# EAGLE schematic 0xD_protov1 v10 (EAGLE 9.7.0)

## Sheet 1 of 2
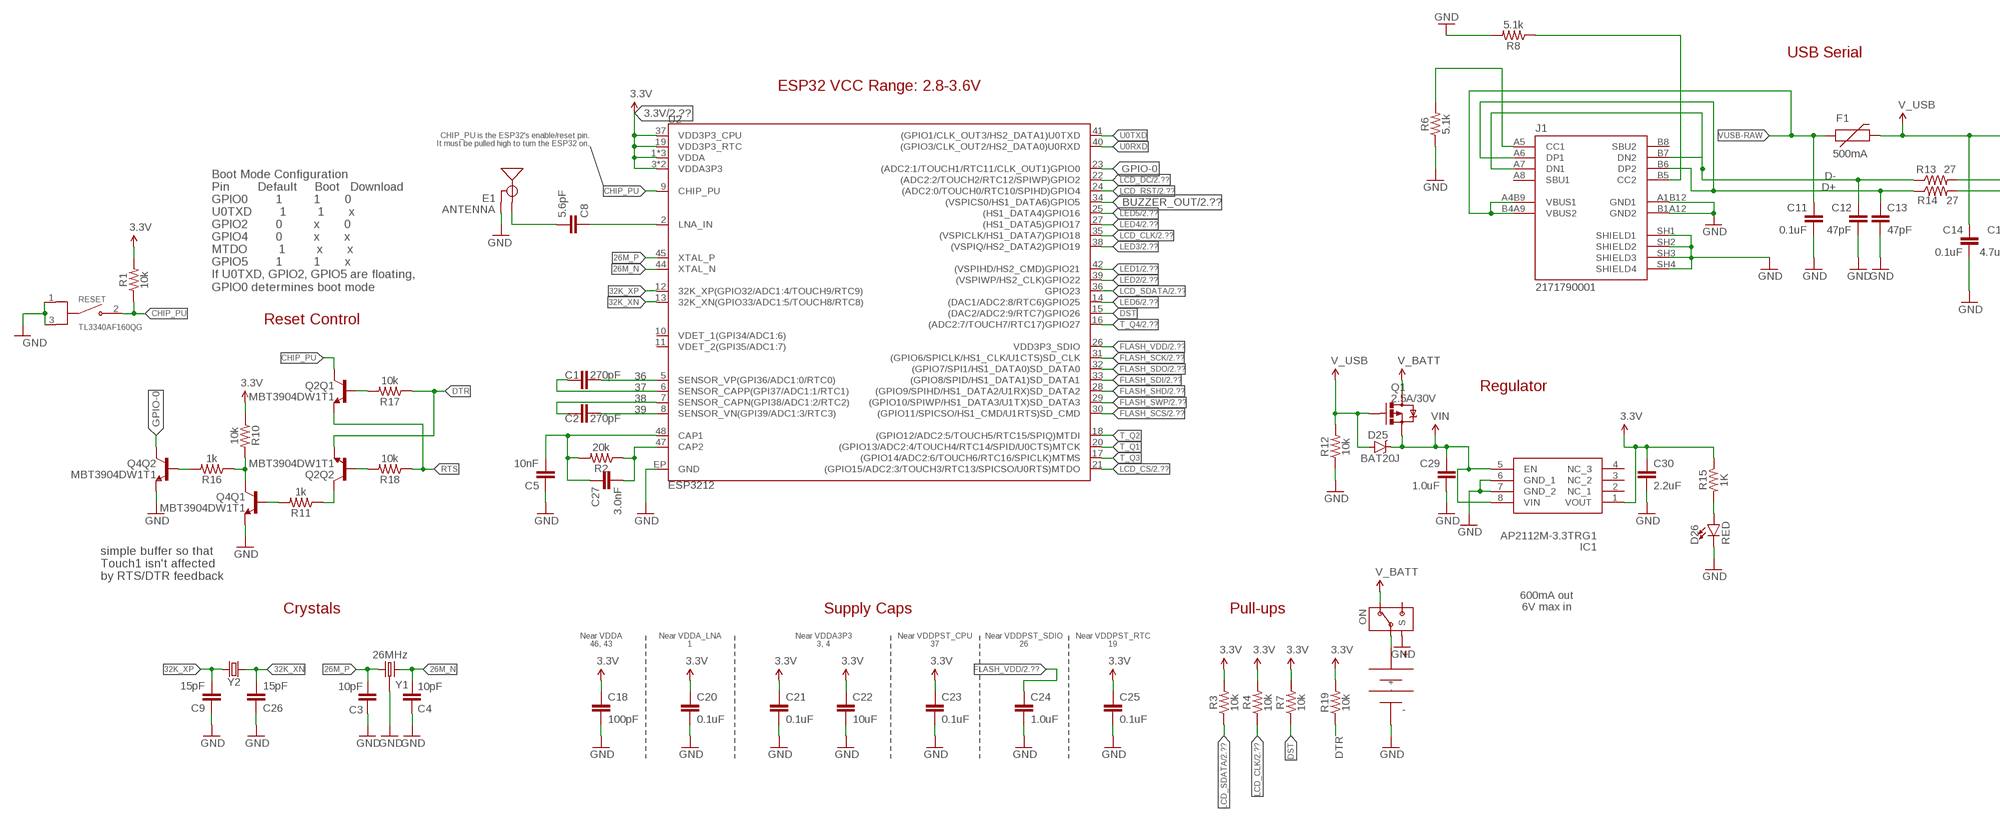
[diagram p0: schematic, sheet 1, part 1 of 2]
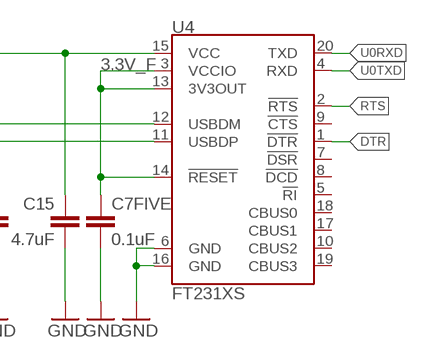
[diagram p1: schematic, sheet 1, part 2 of 2]

### Parts
C1  270pF  270PF-50V-5%(0603)  [0603]
C2  270pF  270PF-50V-5%(0603)  [0603]
C3  10pF  10PF-0603-50V-5%  [0603]
C4  10pF  10PF-0603-50V-5%  [0603]
C5  10nF  10NF-0603-50V-10%  [0603]
C7FIVE  0.1uF  0.1UF-0603-25V-(+80/-20%)  [0603]
C8  5.6pF  5.6PF-50V-5%(0603)  [0603]
C9  15pF  15PF-0603-50V-5%  [0603]
C11  0.1uF  0.1UF-0603-25V-(+80/-20%)  [0603]
C12  47pF  47PF-0603-50V-5%  [0603]
C13  47pF  47PF-0603-50V-5%  [0603]
C14  0.1uF  0.1UF-0603-25V-(+80/-20%)  [0603]
C15  4.7uF  0.1UF-0603-25V-(+80/-20%)  [0603]
C18  100pF  100PF-0603-50V-5%  [0603]
C20  0.1uF  0.1UF-0603-25V-(+80/-20%)  [0603]
C21  0.1uF  0.1UF-0603-25V-(+80/-20%)  [0603]
C22  10uF  10UF-0603-6.3V-20%  [0603]
C23  0.1uF  0.1UF-0603-25V-(+80/-20%)  [0603]
C24  1.0uF  1.0UF-0603-16V-10%  [0603]
C25  0.1uF  0.1UF-0603-25V-(+80/-20%)  [0603]
C26  15pF  15PF-0603-50V-5%  [0603]
C27  3.0nF  3.0NF-0603-50V-5%  [0603]
C29  1.0uF  1.0UF-0805-25V-(+80/-20%)  [0805]
C30  2.2uF  2.2UF-0603-10V-20%  [0603]
D25  BAT20J  DIODE-SCHOTTKY-BAT20J  [SOD-323]
D26  RED  LED-RED0603  [LED-0603@1]
E1  ANTENNA  ANTENNATRACE-TUNED  [TRACE_ANTENNA_2.4GHZ_25.7MM_TUNED]
F1  500mA  PTCSMD  [PTC-1206]
G2  KEYSTONE_2479  [KEYSTONE_2479]
IC1  AP2112M-3.3TRG1  [SOIC127P600X170-8N]
J1  2171790001  [MOLEX_2171790001]
ON  CUS-12B  [CUS-12_SPDT]
Q1  2.5A/30V  MOSFET-PCHANNELDMG2307L  [SOT23-3@1]
Q2  MBT3904DW1T1  [SC70-6]
Q4  MBT3904DW1T1  [SC70-6]
R1  10k  10KOHM-1/10W-1%(0603)0603  [0603]
R2  20k  20KOHM-0603-1/10W-1%  [0603]
R3  10k  10KOHM-0603-1/10W-1%  [0603]
R4  10k  10KOHM-0603-1/10W-1%  [0603]
R6  5.1k  10KOHM-0603-1/10W-1%  [0603]
R7  10k  10KOHM-0603-1/10W-1%  [0603]
R8  5.1k  10KOHM-0603-1/10W-1%  [0603]
R10  10k  10KOHM-0603-1/10W-1%  [0603]
R11  1k  10KOHM-0603-1/10W-1%  [0603]
R12  10k  10KOHM-0603-1/10W-1%  [0603]
R13  27  27OHM1/10W1%(0603)0603-RES  [0603]
R14  27  27OHM1/10W1%(0603)0603-RES  [0603]
R15  1K  1KOHM-1/10W-1%(0603)  [0603]
R16  1k  10KOHM-0603-1/10W-1%  [0603]
R17  10k  10KOHM-0603-1/10W-1%  [0603]
R18  10k  10KOHM-0603-1/10W-1%  [0603]
R19  10k  10KOHM-0603-1/10W-1%  [0603]
RESET  TL3340AF160QG  [SW_TL3340AF160QG]
U2  ESP3212  [QFN48-0.4MM]
U4  FT231XS  [SSOP20_L]
Y1  26MHz  CRYSTAL-GROUNDED3.2X2.5  [CRYSTAL-SMD-3.2X2.5]
Y2  32.768kHz  FC-12M  [FC-12M]

### Nets
3.3V: C18.1 C20.1 C21.1 C22.1 C23.1 C25.1 C30.1 IC1.1(VOUT) R1.2 R3.2 R4.2 R7.2 R10.1 R15.1 R19.2 U2.1(VDDA) U2.3(VDDA3P3) U2.4(VDDA3P3) U2.19(VDD3P3_RTC) U2.37(VDD3P3_CPU) U2.43(VDDA) U2.46(VDDA) ; also sheet 2
3.3V_F: C7FIVE.1 U4.3(VCCIO) U4.13(3V3OUT) U4.14(!RESET)
26M_N: C4.2 U2.44(XTAL_N) Y1.3
26M_P: C3.2 U2.45(XTAL_P) Y1.1
32K_XN: C26.2 U2.13(32K_XN(GPIO33/ADC1:5/TOUCH8/RTC8)) Y2.2
32K_XP: C9.2 U2.12(32K_XP(GPIO32/ADC1:4/TOUCH9/RTC9)) Y2.1
36: C1.2 U2.5(SENSOR_VP(GPI36/ADC1:0/RTC0))
37: C1.1 U2.6(SENSOR_CAPP(GPI37/ADC1:1/RTC1))
38: C2.1 U2.7(SENSOR_CAPN(GPI38/ADC1:2/RTC2))
39: C2.2 U2.8(SENSOR_VN(GPI39/ADC1:3/RTC3))
BUZZER_OUT: U2.34((VSPICS0/HS1_DATA6)GPIO5) ; also sheet 2
CAP_10N: C5.2 C27.1 R2.2 U2.48(CAP1)
CHIP_PU: Q2.3(Q1:C) R1.1 RESET.2(NO) U2.9(CHIP_PU)
D+: C13.1 J1.A6(DP1) J1.B6(DP2) R14.1
D-: C12.1 J1.A7(DN1) J1.B7(DN2) R13.1
DST: R7.1 U2.15((DAC2/ADC2:9/RTC7)GPIO26)
DTR: Q2.1(Q2:E) R17.1 R19.1 U4.1(!DTR)
FLASH_SCK: U2.31((GPIO6/SPICLK/HS1_CLK/U1CTS)SD_CLK) ; also sheet 2
FLASH_SCS: U2.30((GPIO11/SPICSO/HS1_CMD/U1RTS)SD_CMD) ; also sheet 2
FLASH_SDI: U2.33((GPIO8/SPID/HS1_DATA1)SD_DATA1) ; also sheet 2
FLASH_SDO: U2.32((GPIO7/SPI1/HS1_DATA0)SD_DATA0) ; also sheet 2
FLASH_SHD: U2.28((GPIO9/SPIHD/HS1_DATA2/U1RX)SD_DATA2) ; also sheet 2
FLASH_SWP: U2.29((GPIO10/SPIWP/HS1_DATA3/U1TX)SD_DATA3) ; also sheet 2
FLASH_VDD: C24.1 U2.26(VDD3P3_SDIO) ; also sheet 2
GND: C3.1 C4.1 C5.1 C7FIVE.2 C9.1 C11.2 C12.2 C13.2 C14.2 C15.2 C18.2 C20.2 C21.2 C22.2 C23.2 C24.2 C25.2 C26.1 C29.2 C30.2 D26.C E1.GND E1.GND2(GND) G2.- IC1.6(GND_1) IC1.7(GND_2) J1.A1B12(GND1) J1.B1A12(GND2) J1.SH1(SHIELD1) J1.SH2(SHIELD2) J1.SH3(SHIELD3) J1.SH4(SHIELD4) ON.P$4(S) ON.P$5(S) ON.P$6(S) ON.P$7(S) Q4.1(Q2:E) Q4.4(Q1:E) R6.1 R8.2 R12.1 RESET.1(COM_1) RESET.3(COM_2) U2.EP(GND) U4.6(GND) U4.16(GND) Y1.2(GND) Y1.4(GND) ; also sheet 2
GPIO-0: Q4.6(Q2:C) U2.23((ADC2:1/TOUCH1/RTC11/CLK_OUT1)GPIO0)
LCD_CLK: R4.1 U2.35((VSPICLK/HS1_DATA7)GPIO18) ; also sheet 2
LCD_CS: U2.21((GPIO15/ADC2:3/TOUCH3/RTC13/SPICSO/U0RTS)MTDO) ; also sheet 2
LCD_DC: U2.22((ADC2:2/TOUCH2/RTC12/SPIWP)GPIO2) ; also sheet 2
LCD_RST: U2.24((ADC2:0/TOUCH0/RTC10/SPIHD)GPIO4) ; also sheet 2
LCD_SDATA: R3.1 U2.36(GPIO23) ; also sheet 2
LED1: U2.42((VSPIHD/HS2_CMD)GPIO21) ; also sheet 2
LED2: U2.39((VSPIWP/HS2_CLK)GPIO22) ; also sheet 2
LED3: U2.38((VSPIQ/HS2_DATA2)GPIO19) ; also sheet 2
LED4: U2.27((HS1_DATA5)GPIO17) ; also sheet 2
LED5: U2.25((HS1_DATA4)GPIO16) ; also sheet 2
LED6: U2.14((DAC1/ADC2:8/RTC6)GPIO25) ; also sheet 2
LNA_IN: C8.1 U2.2(LNA_IN)
N$4: C27.2 R2.1 U2.47(CAP2)
N$5: J1.A5(CC1) R6.2
N$7: R13.2 U4.12(USBDM)
N$8: R14.2 U4.11(USBDP)
N$9: Q4.2(Q2:B) R16.2
N$10: Q2.5(Q1:B) R17.2
N$11: J1.B5(CC2) R8.1
N$12: Q2.2(Q2:B) R18.2
N$13: Q4.3(Q1:C) R10.2 R16.1
N$14: Q4.5(Q1:B) R11.2
N$15: Q2.6(Q2:C) R11.1
N$16: G2.+ ON.P$2
N$18: D26.A R15.2
RTS: Q2.4(Q1:E) R18.1 U4.2(!RTS)
T_Q1: U2.20((GPIO13/ADC2:4/TOUCH4/RTC14/SPID/U0CTS)MTCK)
T_Q2: U2.18((GPIO12/ADC2:5/TOUCH5/RTC15/SPIQ)MTDI)
T_Q3: U2.17((GPIO14/ADC2:6/TOUCH6/RTC16/SPICLK)MTMS)
T_Q4: U2.16((ADC2:7/TOUCH7/RTC17)GPIO27) ; also sheet 2
TRACE_ANT: C8.2 E1.ANT(SIGNAL)
U0RXD: U2.40((GPIO3/CLK_OUT2/HS2_DATA0)U0RXD) U4.20(TXD)
U0TXD: U2.41((GPIO1/CLK_OUT3/HS2_DATA1)U0TXD) U4.4(RXD)
V_BATT: ON.P$1 Q1.3(D)
V_USB: C14.1 C15.1 D25.A F1.2 Q1.1(G) R12.2 U4.15(VCC)
VIN: C29.1 D25.C IC1.5(EN) IC1.8(VIN) Q1.2(S)
VUSB-RAW: C11.1 F1.1 J1.A4B9(VBUS1) J1.B4A9(VBUS2)
Unconnected: IC1.2(NC_1) IC1.3(NC_2) IC1.4(NC_3) J1.A8(SBU1) J1.B8(SBU2) ON.P$3 U2.10(VDET_1(GPI34/ADC1:6)) U2.11(VDET_2(GPI35/ADC1:7)) U4.5(!RI) U4.7(!DSR) U4.8(!DCD) U4.9(!CTS) U4.10(CBUS2) U4.17(CBUS1) U4.18(CBUS0) U4.19(CBUS3)

### Notes on the sheet
- USB Serial
- ESP32 VCC Range: 2.8-3.6V
- CHIP_PU is the ESP32's enable/reset pin.
  It must be pulled high to turn the ESP32 on.
- Boot Mode Configuration
  Pin        Default     Boot   Download
  GPIO0        1         1       0
  U0TXD        1         1       x
  GPIO2        0         x       0
  GPIO4        0         x       x
  MTDO         1         x       x
  GPIO5        1         1       x
  If U0TXD, GPIO2, GPIO5 are floating, 
  GPIO0 determines boot mode
- Reset Control
- Regulator
- simple buffer so that
  Touch1 isn't affected
  by RTS/DTR feedback
- 600mA out
  6V max in
- Crystals | Supply Caps | Pull-ups
- Near VDDA
  46, 43
- Near VDDA_LNA
  1
- Near VDDA3P3
  3, 4
- Near VDDPST_CPU
  37
- Near VDDPST_SDIO
  26
- Near VDDPST_RTC
  19

## Sheet 2 of 2
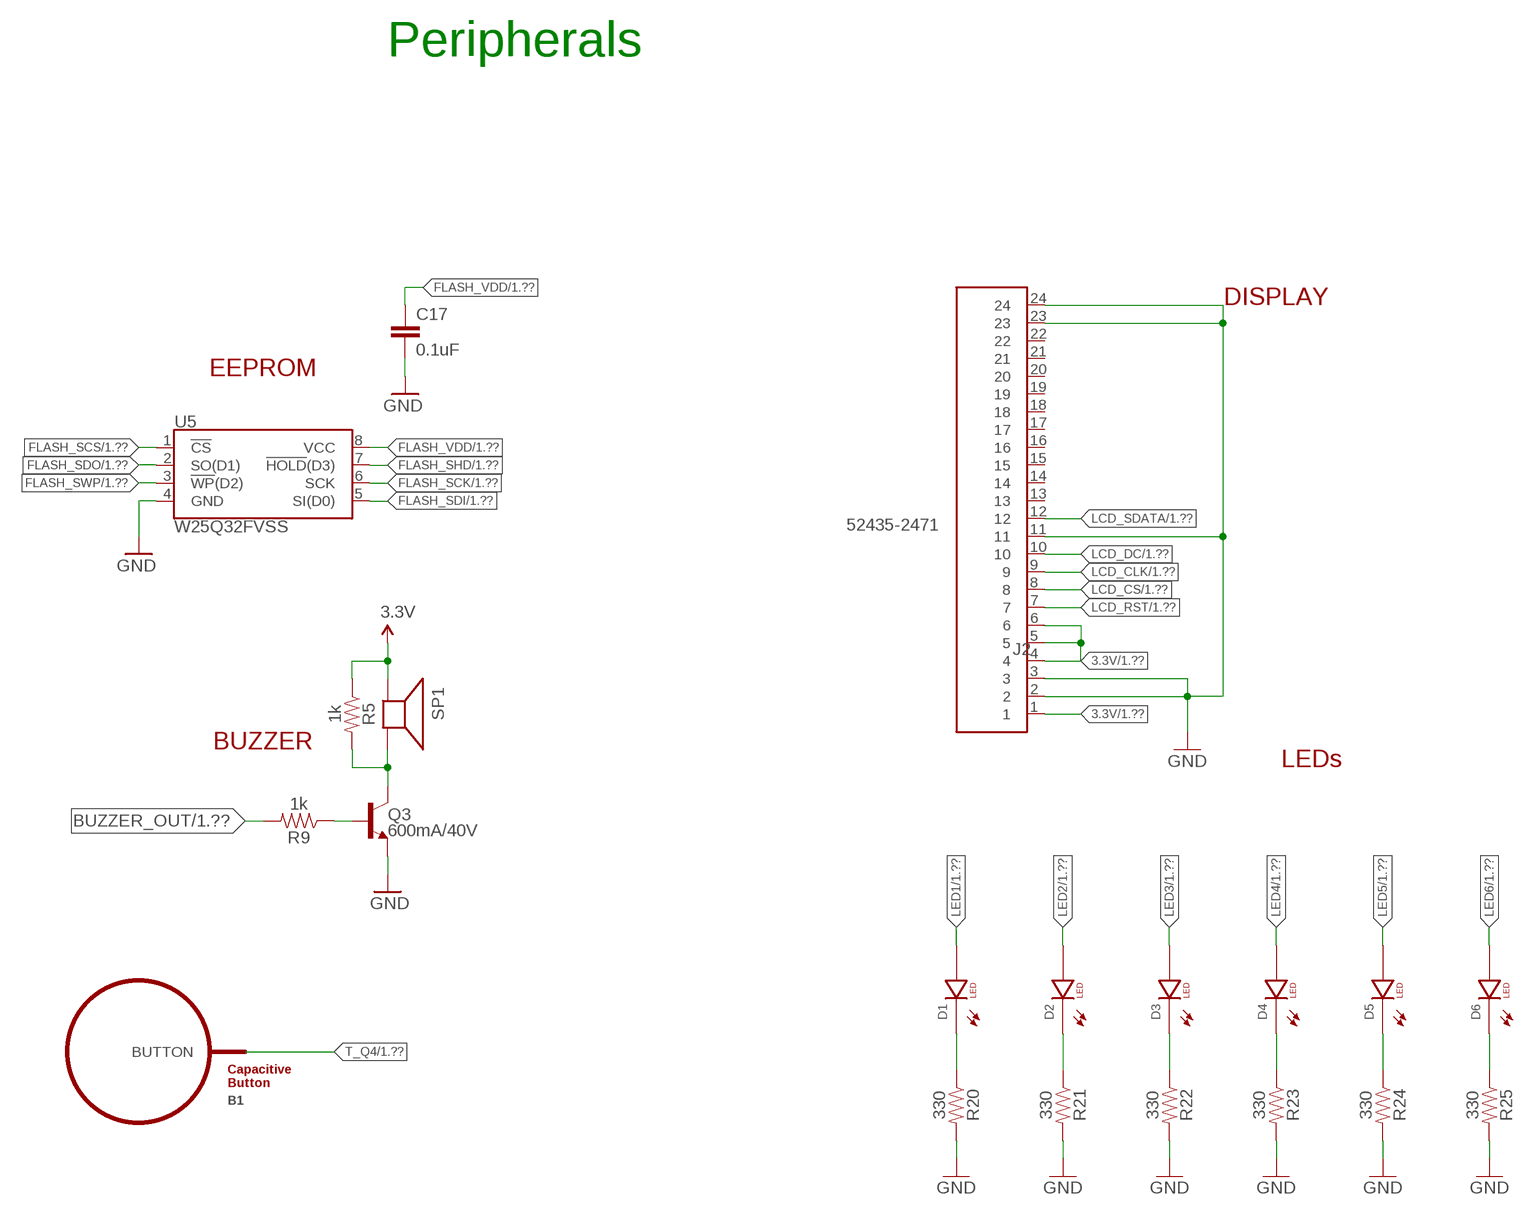
[diagram p2: schematic, sheet 2]

### Parts
B1  BUTTON_PASSIVE12MM  [BUTTON_PASSIVE_12MM]
C17  0.1uF  0.1UF-0603-25V-(+80/-20%)  [0603]
D1  XZDGK45WT-9-GREEN-REV  [XZ-PLCC2-REV-HOLE]
D2  XZDGK45WT-9-GREEN-REV  [XZ-PLCC2-REV-HOLE]
D3  XZDGK45WT-9-GREEN-REV  [XZ-PLCC2-REV-HOLE]
D4  XZDGK45WT-9-GREEN-REV  [XZ-PLCC2-REV-HOLE]
D5  XZDGK45WT-9-GREEN-REV  [XZ-PLCC2-REV-HOLE]
D6  XZDGK45WT-9-GREEN-REV  [XZ-PLCC2-REV-HOLE]
J2  52435-2471  [MOLEX_52435-2471]
Q3  600mA/40V  TRANS_NPN-MMBT2222AL  [SOT23-3]
R5  1k  10KOHM-0603-1/10W-1%  [0603]
R9  1k  10KOHM-0603-1/10W-1%  [0603]
R20  330  10KOHM-0603-1/10W-1%  [0603]
R21  330  10KOHM-0603-1/10W-1%  [0603]
R22  330  10KOHM-0603-1/10W-1%  [0603]
R23  330  10KOHM-0603-1/10W-1%  [0603]
R24  330  10KOHM-0603-1/10W-1%  [0603]
R25  330  10KOHM-0603-1/10W-1%  [0603]
SP1  SPEAKER/PS12  [PS12]
U5  W25Q32FVSS  [SOIC-8]

### Nets
3.3V: J2.1 J2.4 J2.5 J2.6 R5.1 SP1.P$1(+) ; also sheet 1
BUZZER_OUT: R9.2 ; also sheet 1
FLASH_SCK: U5.6(SCK) ; also sheet 1
FLASH_SCS: U5.1(!CS!) ; also sheet 1
FLASH_SDI: U5.5(SI(D0)) ; also sheet 1
FLASH_SDO: U5.2(SO(D1)) ; also sheet 1
FLASH_SHD: U5.7(!HOLD!(D3)) ; also sheet 1
FLASH_SWP: U5.3(!WP!(D2)) ; also sheet 1
FLASH_VDD: C17.1 U5.8(VCC) ; also sheet 1
GND: C17.2 J2.2 J2.3 J2.11 J2.23 J2.24 Q3.2(E) R20.2 R21.2 R22.2 R23.2 R24.2 R25.2 U5.4(GND) ; also sheet 1
LCD_CLK: J2.9 ; also sheet 1
LCD_CS: J2.8 ; also sheet 1
LCD_DC: J2.10 ; also sheet 1
LCD_RST: J2.7 ; also sheet 1
LCD_SDATA: J2.12 ; also sheet 1
LED1: D1.ANODE ; also sheet 1
LED2: D2.ANODE ; also sheet 1
LED3: D3.ANODE ; also sheet 1
LED4: D4.ANODE ; also sheet 1
LED5: D5.ANODE ; also sheet 1
LED6: D6.ANODE ; also sheet 1
N$1: D1.CATHODE R20.1
N$2: D2.CATHODE R21.1
N$3: Q3.3(C) R5.2 SP1.P$2(-)
N$6: D3.CATHODE R22.1
N$17: D4.CATHODE R23.1
N$19: D5.CATHODE R24.1
N$20: D6.CATHODE R25.1
N$26: Q3.1(B) R9.1
T_Q4: B1.BUTTON ; also sheet 1
Unconnected: J2.13 J2.14 J2.15 J2.16 J2.17 J2.18 J2.19 J2.20 J2.21 J2.22

### Notes on the sheet
- Peripherals
- DISPLAY
- EEPROM
- BUZZER
- LEDs
- 1 LEDA LED Anode 
  2 LEDK LED Cathode 
  3 GND Power Ground 
  4 VDD-2.8V Power Supply for Analog,VDD-2.8V=2.5V-3.3V 
  5 VDDIO Power Supply for I/O system. IOVCC=1.65V-3.3V 
  6 IM1/2 When IM1/2=1,4-SPI interface. When IM1/2=0,8080-8bit parallel interface. 
  7 RESET This signal will reset the device and it must be applied to properly initialize the chip. Signal is active low 
  8 CS Chip selection Pin. Low=Enable, High= Disable 
  9 D/C(SCL) Display data/command selection pin in parallel interface. This pin is used to be serial interface clock 
  10 WR(D/C) Write enable in MCU parallel interface. Display data/command selection pin in 4-line serial interface.
  11 RD Read enable in 8080 MCU parallel interface. If not used, please fix this pin at VDDI or DGND. 
  12 SDA When IM3: Low, SPI interface input/output pin. When IM3: High, SPI interface input pin. The data is latched on the rising edge of the SCL signal. If not used, please fix this pin at VDDI or DGND level. 
  13~20 DB0~DB7 MCU parallel interface data
   21 TE Tearing effect signal is used to synchronize MCU to frame memory writing 
  22 NC No Connect 23~24 GND Power Ground1 LEDA LED Anode 
  2 LEDK LED Cathode 
  3 GND Power Ground 
  4 VDD-2.8V Power Supply for Analog,VDD-2.8V=2.5V-3.3V 
  5 VDDIO Power Supply for I/O system. IOVCC=1.65V-3.3V 
  6 IM1/2 When IM1/2=1,4-SPI interface. When IM1/2=0,8080-8bit parallel interface. 
  7 RESET This signal will reset the device and it must be applied to properly initialize the chip. Signal is active low 
  8 CS Chip selection Pin. Low=Enable, High= Disable 
  9 D/C(SCL) Display data/command selection pin in parallel interface. This pin is used to be serial interface clock 
  10 WR(D/C) Write enable in MCU parallel interface. Display data/command selection pin in 4-line serial interface.
  11 RD Read enable in 8080 MCU parallel interface. If not used, please fix this pin at VDDI or DGND. 
  12 SDA When IM3: Low, SPI interface input/output pin. When IM3: High, SPI interface input pin. The data is latched on the rising edge of the SCL signal. If not used, please fix this pin at VDDI or DGND level. 
  13~20 DB0~DB7 MCU parallel interface data
   21 TE Tearing effect signal is used to synchronize MCU to frame memory writing 
  22 NC No Connect 23~24 GND Power Ground

## Library data of the parts
B1 = PatternAgents-TouchWidgets:BUTTON_PASSIVE: Button, Passive Capacitive/Touch Sensing Type Source : http://www.PatternAgents.com Github : https://github.com/PatternAgents License : http://creativecommons.org/licenses/by-sa/3.1/ (Creative Commons 3.1) THIS SOFTWARE IS PROVIDED BY THE CONTRIBUTORS "AS IS" AND WITHOUT ANY EXPRESS OR IMPLIED WARRANTIES, INCLUDING, BUT NOT LIMITED TO, THE IMPLIED WARRANTIES OF MERCHANTABILITY AND FITNESS FOR A PARTICULAR PURPOSE ARE DISCLAIMED. IN NO EVENT SHALL THE COPYRIGHT OWNER OR CONTRIBUTORS BE LIABLE FOR ANY DIRECT, INDIRECT, INCIDENTAL, SPECIAL, EXEMPLARY, OR CONSEQUENTIAL DAMAGES (INCLUDING, BUT NOT LIMITED TO, PROCUREMENT OF SUBSTITUTE GOODS OR SERVICES; LOSS OF USE, DATA, OR PROFITS; OR BUSINESS INTERRUPTION) HOWEVER CAUSED AND ON ANY THEORY OF LIABILITY, WHETHER IN CONTRACT, STRICT LIABILITY, OR TORT (INCLUDING NEGLIGENCE OR OTHERWISE) ARISING IN ANY WAY OUT OF THE USE OF THIS SOFTWARE, EVEN IF ADVISED OF THE POSSIBILITY OF SUCH DAMAGE.
C1 C2 = esp32-thing-temp:270PF-50V-5%(0603): CAP-13339; PROD_ID: CAP-13339
C3 C4 = SparkFun-Capacitors:10PF: 10pF ceramic capacitors A capacitor is a passive two-terminal electrical component used to store electrical energy temporarily in an electric field.; PROD_ID: CAP-11812
C5 = SparkFun-Capacitors:10NF: 0.01uF/10nF/10,000pF ceramic capacitors A capacitor is a passive two-terminal electrical component used to store electrical energy temporarily in an electric field. CAP-09321; PROD_ID: CAP-00867
C7FIVE C11 C14 C17 C20 C21 C23 C25 = SparkFun-Capacitors:0.1UF: 0.1µF ceramic capacitors A capacitor is a passive two-terminal electrical component used to store electrical energy temporarily in an electric field.; PROD_ID: CAP-00810
C8 = esp32-thing-temp:5.6PF-50V-5%(0603): CAP-12456; PROD_ID: CAP-12456
C9 C26 = SparkFun-Capacitors:15PF: 15pF ceramic capacitors A capacitor is a passive two-terminal electrical component used to store electrical energy temporarily in an electric field.; PROD_ID: CAP-07881
C12 C13 = SparkFun-Capacitors:47PF: 47pF ceramic capacitors A capacitor is a passive two-terminal electrical component used to store electrical energy temporarily in an electric field.; PROD_ID: CAP-08913
C15 = SparkFun-Capacitors:0.1UF: 0.1µF ceramic capacitors A capacitor is a passive two-terminal electrical component used to store electrical energy temporarily in an electric field.; PROD_ID: CAP-00810; VALUE: 0.1uF
C18 = SparkFun-Capacitors:100PF: 100pF/0.1nF ceramic capacitors A capacitor is a passive two-terminal electrical component used to store electrical energy temporarily in an electric field.; PROD_ID: CAP-07883
C22 = SparkFun-Capacitors:10UF: 10.0µF ceramic capacitors A capacitor is a passive two-terminal electrical component used to store electrical energy temporarily in an electric field.; PROD_ID: CAP-11015
C24 = SparkFun-Capacitors:1.0UF: 1µF ceramic capacitors A capacitor is a passive two-terminal electrical component used to store electrical energy temporarily in an electric field.; PROD_ID: CAP-00868
C27 = esp32-thing-temp:3.0NF: 3.0nF (3nF, 3000pF) ceramic capacitors A capacitor is a passive two-terminal electrical component used to store electrical energy temporarily in an electric field.; PROD_ID: CAP-13515
C29 = SparkFun-Capacitors:1.0UF: 1µF ceramic capacitors A capacitor is a passive two-terminal electrical component used to store electrical energy temporarily in an electric field.; PROD_ID: CAP-11625
C30 = SparkFun-Capacitors:2.2UF: 2.2µF ceramic capacitors A capacitor is a passive two-terminal electrical component used to store electrical energy temporarily in an electric field.; PROD_ID: CAP-07888
D1-D6 = PatternAgents-SunLED:XZDGK45WT-9-GREEN-REV: SunLED XZDGK45WT-9 GREEN LED 3.2 X 2.8MM PLCC2 SMD LED (REVERSE MOUNT) SunLED USA <http://www.sunledusa.com> Source : http://www.PatternAgents.com Github : https://github.com/PatternAgents License : http://creativecommons.org/licenses/by-sa/3.1/ (Creative Commons 3.1) THIS SOFTWARE IS PROVIDED BY THE CONTRIBUTORS "AS IS" AND WITHOUT ANY EXPRESS OR IMPLIED WARRANTIES, INCLUDING, BUT NOT LIMITED TO, THE IMPLIED WARRANTIES OF MERCHANTABILITY AND FITNESS FOR A PARTICULAR PURPOSE ARE DISCLAIMED. IN NO EVENT SHALL THE COPYRIGHT OWNER OR CONTRIBUTORS BE LIABLE FOR ANY DIRECT, INDIRECT, INCIDENTAL, SPECIAL, EXEMPLARY, OR CONSEQUENTIAL DAMAGES (INCLUDING, BUT NOT LIMITED TO, PROCUREMENT OF SUBSTITUTE GOODS OR SERVICES; LOSS OF USE, DATA, OR PROFITS; OR BUSINESS INTERRUPTION) HOWEVER CAUSED AND ON ANY THEORY OF LIABILITY, WHETHER IN CONTRACT, STRICT LIABILITY, OR TORT (INCLUDING NEGLIGENCE OR OTHERWISE) ARISING IN ANY WAY OUT OF THE USE OF THIS SOFTWARE, EVEN IF ADVISED OF THE POSSIBILITY OF SUCH DAMAGE.
D25 = SparkFun-DiscreteSemi:DIODE-SCHOTTKY: Schottky diodes in SFE's production catalog BAT20J 1A 23V 0.62Vf RB751 120mA 40V 0.37Vf PMEG4005EJ 0.5A 40V 0.42Vf MBRA140 1A 40V 0.5Vf B340A 3A 40V SMA; PROD_ID: DIO-11623
D26 = SparkFun-LED:LED-RED: Red SMD LED Used in manufacturing of most products at SparkFun 0603 - SMD 0603 package Forward Voltage: 1.9V Forward Current: 20mA Datasheet: [Product Link] <http://docs.avagotech.com/docs/AV02-0551EN> 0603 SMART - SMD 0603 SMART package ( more efficient and expensive) Forward Voltage: 1.8V Forward Current: 20mA Datasheet: [Product Link] <http://www.osram-os.com/Graphics/XPic2/00077099_0.pdf> 1206 - SMD 1206 package Forward Voltage: 2V Forward Current: 20mA Datasheet: [Product Link] <https://www.sparkfun.com/datasheets/DevTools/LilyPad/Q150OVS4.pdff> 1206 LilyPad - SMD 1206 LilyPad package Forward Voltage: 2V Forward Current: 20mA Datasheet: [Product Link] <https://www.sparkfun.com/datasheets/DevTools/LilyPad/Q150OVS4.pdf>; PROD_ID: DIO-00819
E1 = esp32-thing-temp:ANTENNA: Chip antenna Chip antenna with ground or secondary connection. Common with larger metal RF connectors.
F1 = SparkFun-PowerIC:PTC: Resettable Fuse PTC Resettable Fuse. Spark Fun Electronics SKU : COM-08357; PROD_ID: RES-11150
G2 = keystone:KEYSTONE_2479
IC1 = AP2112M-3.3TRG1:AP2112M-3.3TRG1: LDO Voltage Regulators LDO CMOS HiCurr Source: Datasheet <https://www.diodes.com/assets/Datasheets/AP2112.pdf>; ARROW_PART_NUMBER: AP2112M-3.3TRG1; ARROW_PRICE-STOCK: https://www.arrow.com/en/products/ap2112m-3.3trg1/diodes-incorporated?region=nac; DESCRIPTION: LDO Voltage Regulators LDO CMOS HiCurr; HEIGHT: 1.7mm; MANUFACTURER_NAME: Diodes Inc.; MANUFACTURER_PART_NUMBER: AP2112M-3.3TRG1; MOUSER_PART_NUMBER: 621-AP2112M-3.3TRG1; MOUSER_PRICE-STOCK: https://www.mouser.co.uk/ProductDetail/Diodes-Incorporated/AP2112M-33TRG1?qs=5V6w%252Be2aIqa1YM8VADFBsQ%3D%3D
J1 = 2171790001 - Molex USB C Female Connector:2171790001: Check availability <https://pricing.snapeda.com/parts/2171790001/Molex/view-part?ref=eda>; AVAILABILITY: In Stock; CHECK_PRICES: https://www.snapeda.com/parts/2171790001/Molex/view-part/?ref=eda; DESCRIPTION: Universal Serial Bus (USB) Shielded I/O Receptacle, Type C, Right-Angle, Surface Mount, Top Mount, Single Row, 16 Circuits, Gold (Au) Plating; MF: Molex; MP: 2171790001; PACKAGE: None; PRICE: None; SNAPEDA_LINK: https://www.snapeda.com/parts/2171790001/Molex/view-part/?ref=snap
J2 = 52435-2471:52435-2471: Check availability <https://pricing.snapeda.com/parts/52435-2471/Molex/view-part?ref=eda>; AVAILABILITY: In Stock; CHECK_PRICES: https://www.snapeda.com/parts/52435-2471/Molex/view-part/?ref=eda; DESCRIPTION: 52435 Series 0.5mm Pitch 24 Way Right Angle FPC Connector, ZIF Top Contact | Molex Incorporated 52435-2471; MF: Molex; MP: 52435-2471; PACKAGE: None; PRICE: None; SNAPEDA_LINK: https://www.snapeda.com/parts/52435-2471/Molex/view-part/?ref=snap
ON = IDEO-Switches:CUS-12B
Q1 = SparkFun-DiscreteSemi:MOSFET-PCHANNEL: Generic PMOSFET IRLML2244 - TRANS-11153 (SOT-23 -20V -4.3A) (1.Gate 2.Source 3.Drain) FQP27P06 - COM-10349 <http://www.sparkfun.com/products/10349> (TO-220 -60V -27A) (1.Gate 2.Source 3.Drain); PROD_ID: TRANS-11308
Q2 Q4 = esp32-thing-temp:MBT3904DW1T1: MBT3904DW1 Dual NPN Transistors The MBT3904W1 puts two general purpose 3904 NPN transistors in a single package. Datasheet <http://www.onsemi.com/pub_link/Collateral/MBT3904DW1T1-D.PDF>; PROD_ID: TRANS-13337
Q3 = SparkFun-DiscreteSemi:TRANS_NPN: NPN transistor Current controlled devices typically used to amplify current or used as a switch. BC547 - COM-08928 <http://www.sparkfun.com/products/8928> (TO-92 45V 100mA) (1.Collector 2.Base 3.Emitter) 2N3904 - COM-00521 <http://www.sparkfun.com/products/521> (TO-92 40V 200mA) (1.Emitter 2.Base 3.Collector) P2N2222A - COM-12852 <http://www.sparkfun.com/products/12852> (TO-92 40V 600mA) (1.Collector 2.Base 3.Emitter); PROD_ID: TRANS-08049
R1 = SparkFun-Resistors:10KOHM-1/10W-1%(0603): RES-00824; PROD_ID: RES-00824; VALUE: 10K
R2 = SparkFun-Resistors:20KOHM: 20kΩ resistor A resistor is a passive two-terminal electrical component that implements electrical resistance as a circuit element. Resistors act to reduce current flow, and, at the same time, act to lower voltage levels within circuits. - Wikipedia; PROD_ID: RES-09383
R3 R4 R7 R10 R12 R17-R19 = SparkFun-Resistors:10KOHM: 10kΩ resistor A resistor is a passive two-terminal electrical component that implements electrical resistance as a circuit element. Resistors act to reduce current flow, and, at the same time, act to lower voltage levels within circuits. - Wikipedia; PROD_ID: RES-00824
R5 R6 R8 R9 R11 R16 R20-R25 = SparkFun-Resistors:10KOHM: 10kΩ resistor A resistor is a passive two-terminal electrical component that implements electrical resistance as a circuit element. Resistors act to reduce current flow, and, at the same time, act to lower voltage levels within circuits. - Wikipedia; PROD_ID: RES-00824; VALUE: 10k
R13 R14 = SparkFun-Resistors:27OHM1/10W1%(0603): RES-09334; PROD_ID: RES-09334
R15 = SparkFun-Resistors:1KOHM-1/10W-1%(0603): RES-07856; PROD_ID: RES-07856
RESET = TL3340AF160QG:TL3340AF160QG: Check availability <https://pricing.snapeda.com/parts/TL3340AF160QG/E-Switch/view-part?ref=eda> Check availability <https://pricing.snapeda.com/parts/TL3340AF160QG/E-Switch/view-part?ref=eda>; AVAILABILITY: In Stock; DESCRIPTION: Tactile Switch SPST-NO Side Actuated Surface Mount, Right Angle; MF: E-Switch; MP: TL3340AF160QG; PACKAGE: None; PRICE: None; PURCHASE-URL: https://pricing.snapeda.com/search/part/TL3340AF160QG/?ref=eda
SP1 = adafruit:SPEAKER: SPEAKER Source: Buerklin Added PS12 (for part # PS1240 piezo) http://www.ladyada.net/library/pcb/eaglelibrary.html
U2 = esp32-thing-temp:ESP3212; PROD_ID: IC-13338
U4 = SparkFun-DigitalIC:FT231X: FTDI FT231X Full Speed USB to Full-handshake UART This USB2.0 Full Speed IC offers a compact bridge to full handshake UART interfaces. The device is a UART, capable of operating up to 3MBaud, with low power consumption (8mA). The FT231X includes the complete FT-X series feature set and enables USB to be added into a system design quickly and easily over a UART interface.; PROD_ID: IC-11524
U5 = SparkFun-DigitalIC:W25Q32FV: Winbond W25Q32FV 32Mbit (4MB) Flash The W25Q32FV support the standard Serial Peripheral Interface (SPI), Dual/Quad I/O SPI as well as 2-clocks instruction cycle Quad Peripheral Interface (QPI). Datasheet <http://www.winbond.com/resource-files/w25q32fv%20revh%20091613.pdf>; PROD_ID: IC-13229
Y1 = things:CRYSTAL-GROUNDED; PROD_ID: XTAL-12454
Y2 = crystal:FC-12M: kHz RANGE CRYSTAL UNIT LOW PROFILE SMD Source: Epson Toyocom FC-12M.pdf